# EAGLE design USB (EAGLE 6.1)
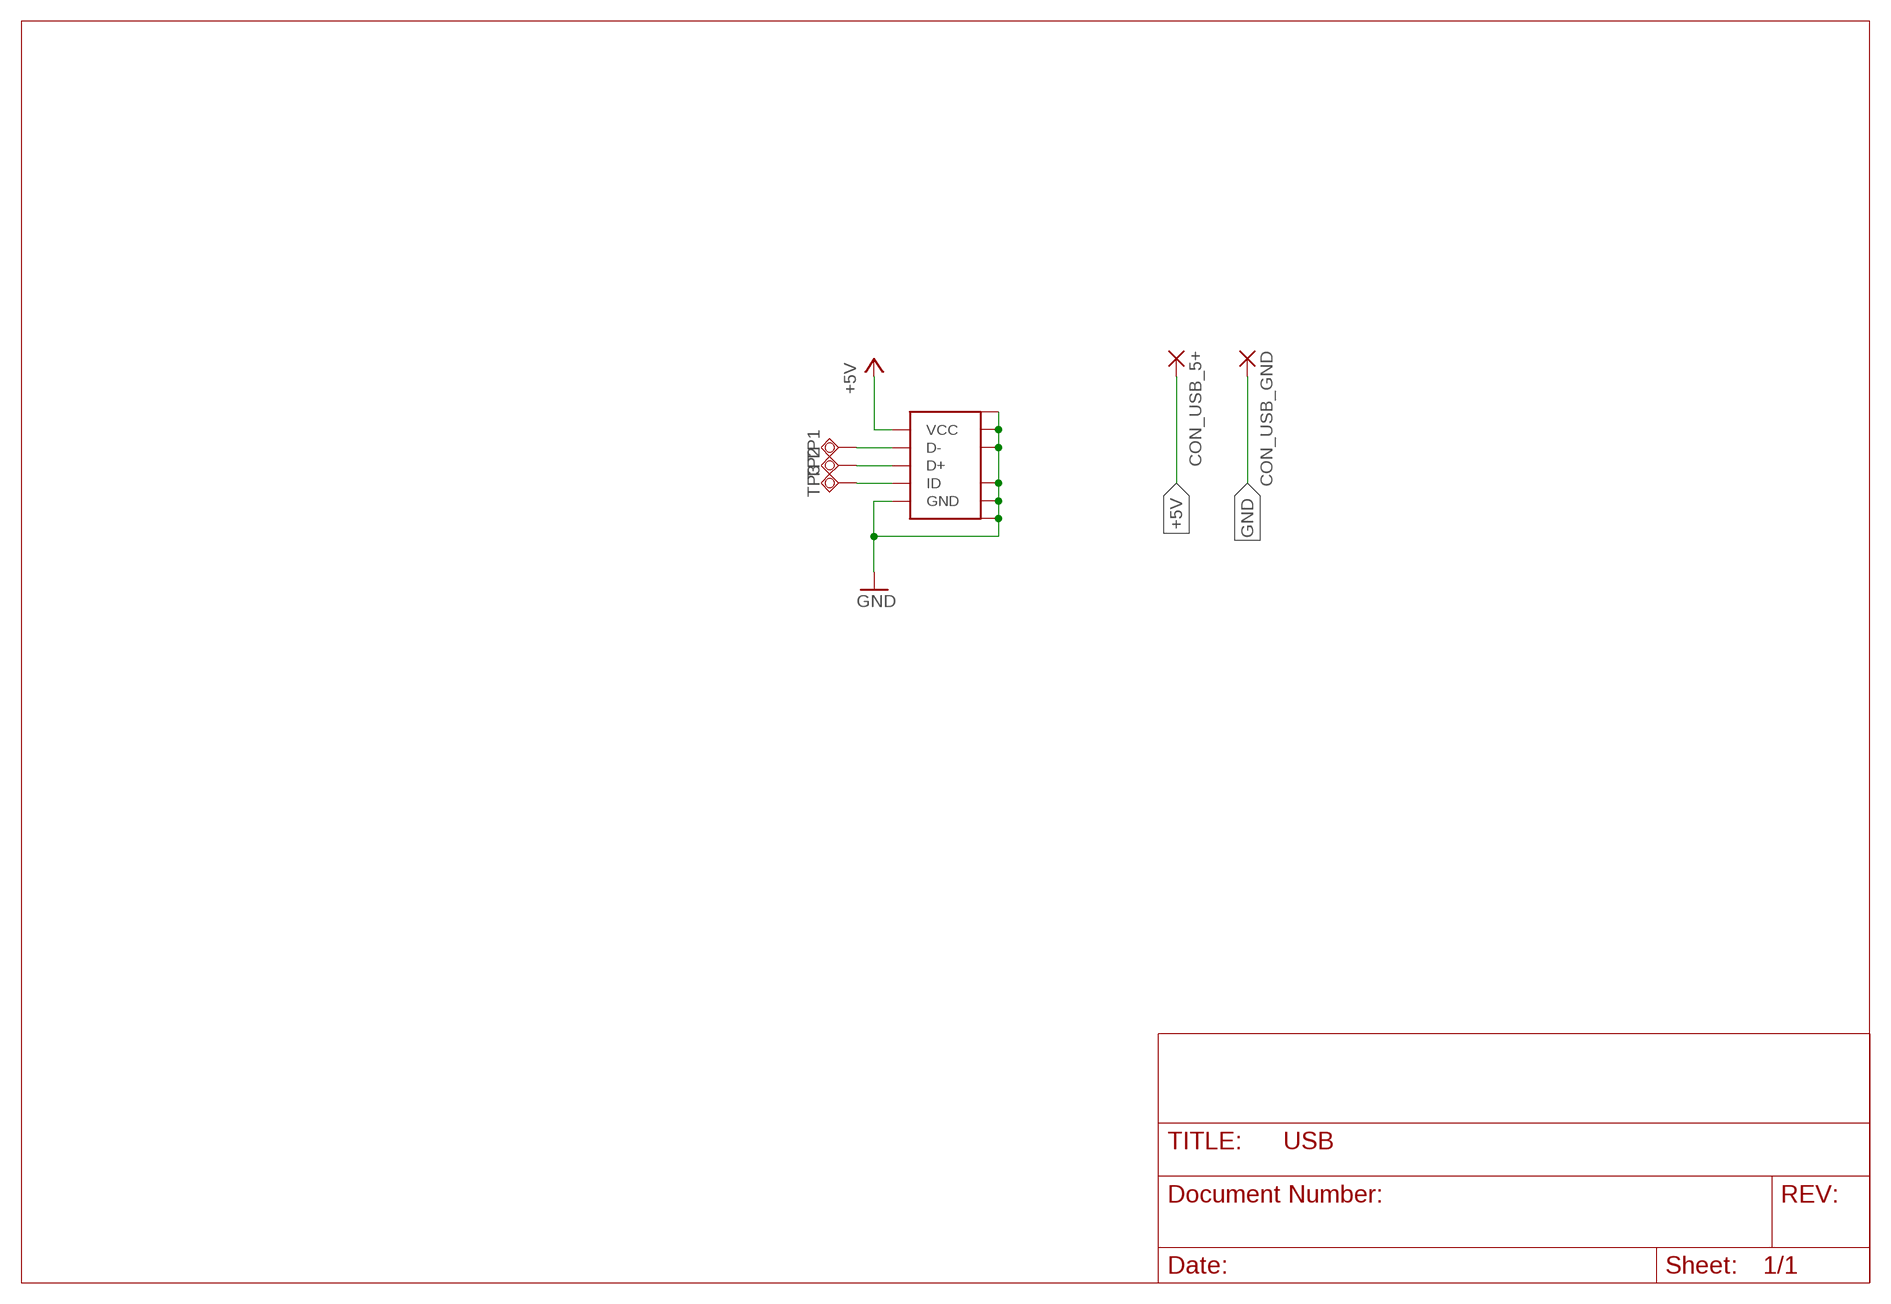
[diagram p0: schematic, sheet 1]

## Parts
CON_USB_5+  SMD5  [SMD2,54-5,08]
CON_USB_GND  SMD5  [SMD2,54-5,08]
TP1  TPSQB1,27  [B1,27]
TP2  TPSQB1,27  [B1,27]
TP3  TPSQB1,27  [B1,27]
U$5  MICRO_USB_B  [MICRO_USB_B]

## Nets
+5V: CON_USB_5+.1(P) U$5.1(VCC)
GND: CON_USB_GND.1(P) U$5.5(GND) U$5.GND1(GND) U$5.GND2(GND) U$5.GND3(GND) U$5.GND4(GND) U$5.GND5(GND) U$5.GND6(GND)
N$1: TP1.TP U$5.2(D-)
N$2: TP2.TP U$5.3(D+)
N$3: TP3.TP U$5.4(ID)

## Library data of the parts
CON_USB_5+ CON_USB_GND = wirepad:SMD5: SMD PAD
TP1-TP3 = testpad:TPSQ: Test pad
U$5 = dan:MICRO_USB_B: Receptáculo micro USB tipo B (móviles). REF tienda (www.rs-online.es): 669-4645. REF fabricante (TE Connectivity): 1981568-1.

## Board
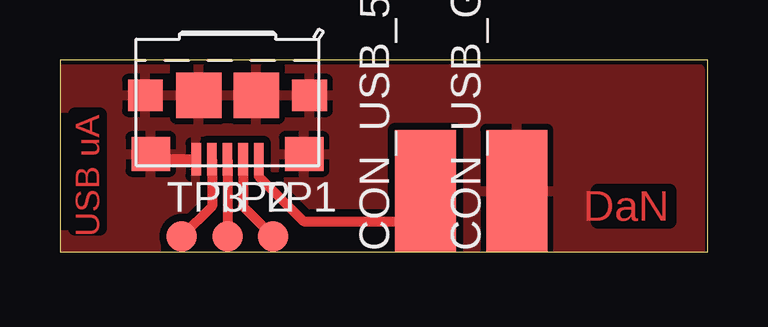
[diagram p1: board, top side]
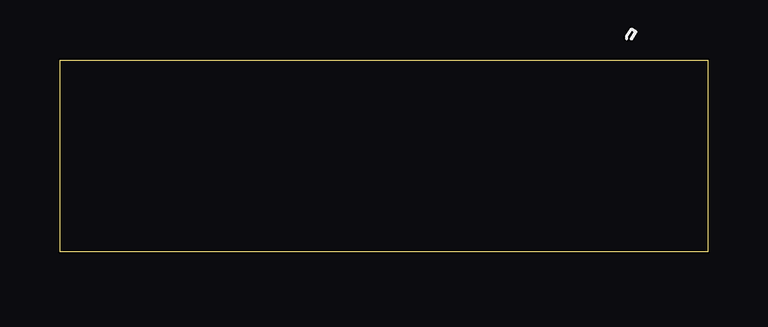
[diagram p2: board, bottom side, seen from below]

Size 27 x 8 mm. Coordinates in mm from the lower left corner, seen from the top.
Outline: 0,0 27,0 27,8 0,8 0,0
Copper layers (1*16): Top 0.035mm / dielectric 1.5mm / Bottom 0.035mm
Design rules: minimum track width 10mil, minimum drill 24mil, track to track 12mil, track to pad 12mil, pad to pad 12mil, via to via 12mil, smd to smd 12mil, copper to edge 1mil, drill to drill 8mil, minimum pad ring 10mil, minimum via ring 8mil, stop-mask expansion 4mil, vias tented up to drill 0mil, thermal gap 10mil

### Footprints (pad centres in the part's own frame; a part is rotated, then mirrored left to right if it is on the bottom)
SMD2,54-5,08 = smd 2.54 x 5.08: 1 0,0
B1,27 = smd 1.27 x 1.27: TP 0,0
MICRO_USB_B = smd 0.4 x 1.35: 1 -1.3,1.865; 2 -0.65,1.865; 3 0,1.865; 4 0.65,1.865; 5 1.3,1.865 | smd 1.6 x 1.4: GND1 -3.2,1.64; GND2 3.2,1.64 | smd 1.45 x 1.3: GND3 -3.425,-0.81; GND4 3.425,-0.81 | smd 1.9 x 1.9: GND5 -1.2,-0.81; GND6 1.2,-0.81

### Placement (x,y rotation side)
CON_USB_5+  15.24,2.54 0 top
CON_USB_GND  19.05,2.54 0 top
TP1  8.89,0.64 0 top
TP2  6.99,0.64 0 top
TP3  5.08,0.64 0 top
U$5  6.99,5.71 180 top

### Tracks (layer width: path | path; a pad name or v marks a point on that pad's centre or on a via)
+5V
  Top 0.406: CON_USB_5+.1 15.24,1.27 10.16,1.27 8.29,3.15 U$5.1
GND
  Top 0.406: U$5.5 4.01,3.85 arc-90 U$5.GND2
  pour Top: 0,7.62 26.67,7.62 26.67,0 0,0
N$1
  Top 0.406: U$5.2 7.63,1.89 TP1.TP
N$2
  Top 0.406: U$5.3 TP2.TP
N$3
  Top 0.406: U$5.4 6.33,1.89 TP3.TP

### Text on the board
Top: USB uA | DaN